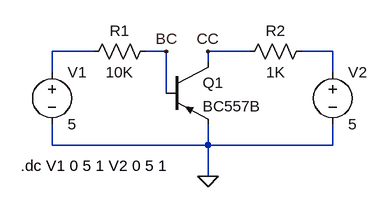
[diagram p0: schematic pnp BJT.asc]
pnp BJT.asc, the LTspice schematic file:
Version 4
SHEET 1 880 680
WIRE 16 80 -48 80
WIRE 128 80 96 80
WIRE 256 80 192 80
WIRE 384 80 336 80
WIRE 192 96 192 80
WIRE -48 112 -48 80
WIRE 384 112 384 80
WIRE 128 144 128 80
WIRE -48 224 -48 192
WIRE 192 224 192 192
WIRE 192 224 -48 224
WIRE 384 224 384 192
WIRE 384 224 192 224
WIRE 192 272 192 224
FLAG 192 272 0
FLAG 128 80 BC
FLAG 192 80 CC
SYMBOL voltage -48 96 R0
WINDOW 123 0 0 Left 0
WINDOW 39 0 0 Left 0
SYMATTR InstName V1
SYMATTR Value 5
SYMBOL voltage 384 96 R0
WINDOW 123 0 0 Left 0
WINDOW 39 0 0 Left 0
SYMATTR InstName V2
SYMATTR Value 5
SYMBOL res 112 64 R90
WINDOW 0 0 56 VBottom 2
WINDOW 3 32 56 VTop 2
SYMATTR InstName R1
SYMATTR Value 10K
SYMBOL res 352 64 R90
WINDOW 0 0 56 VBottom 2
WINDOW 3 32 56 VTop 2
SYMATTR InstName R2
SYMATTR Value 1K
SYMBOL pnp 128 96 R0
SYMATTR InstName Q1
SYMATTR Value BC557B
TEXT -96 256 Left 2 !.dc V1 0 5 1 V2 0 5 1

The netlist it stands for:
* pnp BJT.asc
V1 N001 0 5
V2 N002 0 5
R1 BC N001 10K
R2 N002 CC 1K
Q1 CC BC 0 0 BC557B
.model NPN NPN
.model PNP PNP
.lib standard.bjt
.dc V1 0 5 1 V2 0 5 1
.backanno
.end